# Altium schematic sheet CarrierConnector.SchDoc
size A4; CompanyName: TH Nürnberg; Organization: UltraZohm; Address1: Kesslerplatz 12; Address2: 90489 Nürnberg; Address3: GERMANY; SheetNumber: 2; SheetTotal: 10; CompanyName2: Institut ELSYS
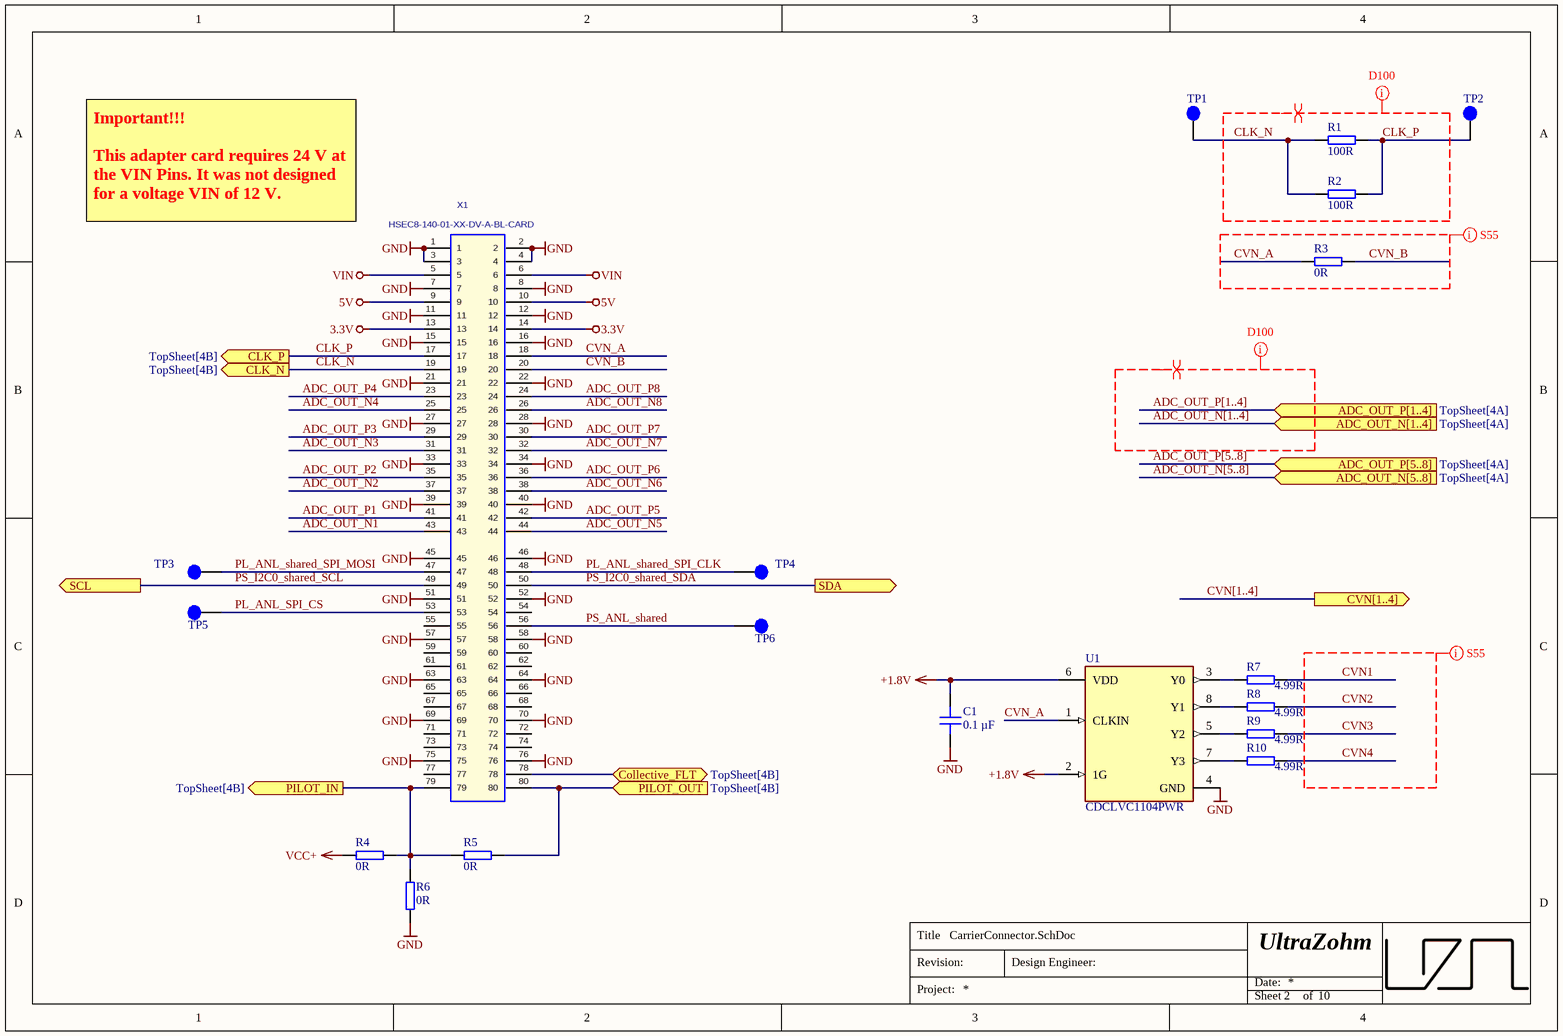
[diagram p0: CarrierConnector.SchDoc]

## Parts
C1  0.1 µF  [C_0603]
R1  100R  [RES 0603_1608]
R2  100R  [RES 0603_1608]
R3  0R  [RES 0603_1608]
R4  0R  [RES 0603_1608]
R5  0R  [RES 0603_1608]
R6  0R  [RES 0603_1608]
R7  4.99R  [RES 0603_1608]
R8  4.99R  [RES 0603_1608]
R9  4.99R  [RES 0603_1608]
R10  4.99R  [RES 0603_1608]
TP1  -  [TP_1mm]  (value not drawn)
TP2  -  [TP_1mm]  (value not drawn)
TP3  -  [TP_1mm]  (value not drawn)
TP4  -  [TP_1mm]  (value not drawn)
TP5  -  [TP_1mm]  (value not drawn)
TP6  -  [TP_1mm]  (value not drawn)
U1  CDCLVC1104PWR  [FP-PW0008A-MFG]
X1  HSEC8-140-01-XX-DV-A-BL-CARD  [HSEC8-140-01-XX-DV-A-BL-CARD]  (no BOM)

## Ports
ADC_OUT_N[1..4] (in, see TopSheet[4A]), ADC_OUT_N[5..8] (in, see TopSheet[4A]), ADC_OUT_P[1..4] (in, see TopSheet[4A]), ADC_OUT_P[5..8] (in, see TopSheet[4A]), CLK_N (out, see TopSheet[4B]), CLK_P (out, see TopSheet[4B]), Collective_FLT (bidir, see TopSheet[4B]), CVN[1..4] (out), PILOT_IN (out, see TopSheet[4B]), PILOT_OUT (in, see TopSheet[4B]), SCL (out), SDA (out)

## Nets
3.3V: X1.13 X1.14
5V: X1.9 X1.10
+1.8V: C1.2 U1.2(1G) U1.6(VDD)
GND: C1.1 R6.1 U1.4(GND) X1.1 X1.2 X1.3 X1.4 X1.7 X1.8 X1.11 X1.12 X1.15 X1.16 X1.21 X1.22 X1.27 X1.28 X1.33 X1.34 X1.39 X1.40 X1.45 X1.46 X1.51 X1.52 X1.57 X1.58 X1.63 X1.64 X1.69 X1.70 X1.75 X1.76
VCC+: R4.1
VIN: X1.5 X1.6
ADC_OUT_N1: X1.43
ADC_OUT_N2: X1.37
ADC_OUT_N3: X1.31
ADC_OUT_N4: X1.25
ADC_OUT_N5: X1.44
ADC_OUT_N6: X1.38
ADC_OUT_N7: X1.32
ADC_OUT_N8: X1.26
ADC_OUT_P1: X1.41
ADC_OUT_P2: X1.35
ADC_OUT_P3: X1.29
ADC_OUT_P4: X1.23
ADC_OUT_P5: X1.42
ADC_OUT_P6: X1.36
ADC_OUT_P7: X1.30
ADC_OUT_P8: X1.24
CLK_N: R1.1 R2.1 TP1.1 X1.19 ; port CLK_N
CLK_P: R1.2 R2.2 TP2.1 X1.17 ; port CLK_P
Collective_FLT: X1.78 ; port Collective_FLT
CVN1: R7.2
CVN2: R8.2
CVN3: R9.2
CVN4: R10.2
CVN_A: R3.1 U1.1(CLKIN) X1.18
CVN_B: R3.2 X1.20
PILOT_IN: R4.2 R5.1 R6.2 X1.79 ; port PILOT_IN
PILOT_OUT: R5.2 X1.80 ; port PILOT_OUT
PL_ANL_shared_SPI_CLK: TP4.1 X1.48
PL_ANL_shared_SPI_MOSI: TP3.1 X1.47
PL_ANL_SPI_CS: TP5.1 X1.53
PS_ANL_shared: TP6.1 X1.56
PS_I2C0_shared_SCL: X1.49 ; port SCL
PS_I2C0_shared_SDA: X1.50 ; port SDA
NetR7_1: R7.1 U1.3(Y0)
NetR8_1: R8.1 U1.8(Y1)
NetR9_1: R9.1 U1.5(Y2)
NetR10_1: R10.1 U1.7(Y3)

Not connected (* = marked no-connect by the designer): X1 54 55 59 60 61 62 65 66 67 68 71 72 73 74 77

## Buses and harness runs
bus ADC_OUT_N[1..4] = port ADC_OUT_N[1..4]
bus ADC_OUT_N[5..8] = port ADC_OUT_N[5..8]
bus ADC_OUT_P[1..4] = port ADC_OUT_P[1..4]
bus ADC_OUT_P[5..8] = port ADC_OUT_P[5..8]
bus CVN[1..4] = port CVN[1..4]

## Layout directives
net class S55: CVN1, CVN2, CVN3, CVN4, CVN_A, CVN_B
differential pair: ADC_OUT_N[1..4], ADC_OUT_P[1..4], CLK_N, CLK_P
net class D100: ADC_OUT_N[1..4], ADC_OUT_P[1..4], CLK_N, CLK_P

## Notes on the sheet
- Important!!!
  This adapter card requires 24 V at the VIN Pins. It was not designed for a voltage VIN of 12 V.
- Title
- Revision:
- Design Engineer:
- Date:
- Project:
- Sheet
- of

## Library data of the parts
C1 = C0603X104K5RAC7411: Capacitor 0603, 50 VDC, 0.1 µF, X7R; Manufacturer: KEMET; Tolerance: 10 %; Voltage Rating: 50 VDC; Created from: MGremer; Manufacturer Part Number: C0603X104K5RAC7411; PartID: 3; Created On: 20.12.2020 13:54:13; ComponentLink1Description: Datasheet; ComponentLink1URL: https://www.mouser.de/datasheet/2/212/1/KEM_C1013_X7R_FT_CAP_SMD-1103280.pdf; Component Type: Capacitor 0603; Device Package: 0603; Last Updated: 04.03.2021 09:24:28; Mounting Type: SMD; Operating Temperature: -55 - 125°C; Series: SMD Comm X7R Flex; Supplier 1: Mouser; Supplier Part Number 1: 80-C0603X104K5R7411; Supplier 2: LCSC; Supplier Part Number 2: C14663; Type: Capacitor; Value: 0.1 µF; Live Cycle Status: 1; LCSC Part Number: C14663; Stock number: Labor SMD Container
R1 R2 = RK73B1JTTD101J: SMD resistor E24 series; Manufacturer: KOA Speer; Tolerance: 5%; Created from: MGremer; Manufacturer Part Number: RK73B1JTTD101J; PartID: 50; Created On: 14.12.2020 16:17:14; ComponentLink1Description: Datasheet; ComponentLink1URL: https://www.mouser.de/datasheet/2/219/RK73B-1825463.pdf; Component Type: SMD resistor; Device Package: 0603; Last Updated: 02.03.2021 14:07:32; Mounting Type: SMD; Supplier 1: Mouser; Supplier Part Number 1: 660-RK73B1JTTD101J; Type: Resistor; Value: 100R; Live Cycle Status: 1; Stock number: Labor SMD Container
R3-R6 = RC0603JR-070RL: SMD resistor E24 series; Manufacturer: YAGEO; Tolerance: 5%; Created from: MGremer; Manufacturer Part Number: RC0603JR-070RL; PartID: 1; Created On: 14.12.2020 16:17:14; ComponentLink1Description: Datasheet; ComponentLink1URL: https://www.mouser.de/datasheet/2/447/PYu-RC_Group_51_RoHS_L_10-1664068.pdf; Component Type: SMD resistor; Device Package: 0603; Last Updated: 04.03.2021 09:09:42; Mounting Type: SMD; Supplier 1: Mouser; Supplier Part Number 1: 603-RC0603JR-070RL; Supplier 2: LCSC; Supplier Part Number 2: C21189; Type: Resistor; Value: 0R; Live Cycle Status: 1; Stock number: Labor SMD Container; LCSC Part Number: C21189
R7-R10 = CRCW06034R99FKEA: SMD resistor 1%; Manufacturer: Vishay / Dale; Created from: MGremer; Manufacturer Part Number: CRCW06034R99FKEA; PartID: 178; Created On: 14.12.2020 16:17:14; ComponentLink1Description: Datasheet; ComponentLink1URL: https://www.mouser.de/datasheet/2/427/dcrcwe3-1762152.pdf; Component Type: SMD resistor; Device Package: 0603; Last Updated: 02.03.2021 14:07:32; Mounting Type: SMD; Supplier 1: Mouser; Supplier Part Number 1: 71-CRCW0603-4.99-E3; Type: Resistor; Tolerance: 1%; Value: 4.99R; Live Cycle Status: 1; Stock number: not stored
TP1-TP6 = -: Test Point 1 mm; Value: TP; Created from: MGremer; Created: 2018_06_25_AGeiger; Manufacturer Part Number: -; PartID: 9; Created On: 02.03.2021 14:59:37; ComponentLink1Description: Datasheet; ComponentLink1URL: -; ComponentLink2Description: Homepage; ComponentLink2URL: -; Component Type: Test Point; Device Package: SMD; Last Updated: 08.10.2021 21:16:06; Manufacturer: -; Minimum Order: 1; Mounting Type: SMD; Supplier 1: -; Supplier Part Number 1: -; Type: Test point; Live Cycle Status: 1; Stock number: not stored
U1 = CDCLVC1104PWR: High Performance Clock Puffer, 1:4 LVCMOS Fan-out; Manufacturer: Texas Instruments; Created from: MGremer; Manufacturer Part Number: CDCLVC1104PWR; PartID: 5; Created On: 04.02.2021 10:13:41; ComponentLink1Description: Datasheet; ComponentLink1URL: https://www.ti.com/general/docs/suppproductinfo.tsp?distId=26&gotoUrl=http%253A%252F%252Fwww.ti.com%252Flit%252Fgpn%252Fcdclvc1104; Component Type: High Performance Clock Puffer; Device Package: TSSOP-8; Last Updated: 04.02.2021 10:13:41; Mounting Type: SMD; Operating Temperature: -40 - 85 °C; Series: CDCLVC1104; Supplier 1: Mouser; Supplier Part Number 1: 595-CDCLVC1104PWR; Type: Clock Puffer; Value: 1:4; Live Cycle Status: 1; Stock number: not stored
X1 = HSEC8-140-01-XX-DV-A-BL-CARD: Mating Card Layout for HSEC8-140-01-XX-DV-A-BL; Manufacturer: SAMTEC; Created: 2018_04_23_AGeiger; Value: HSEC8-140-01-XX-DV-A-BL-CARD; ComponentLink1Description: Info; ComponentLink1URL: https://www.samtec.com/de/products/hsec8-140-01-l-dv-a-bl-k-tr